# Altium schematic sheet Sheet1.SchDoc
size A; SheetNumber: 2; SheetTotal: 2
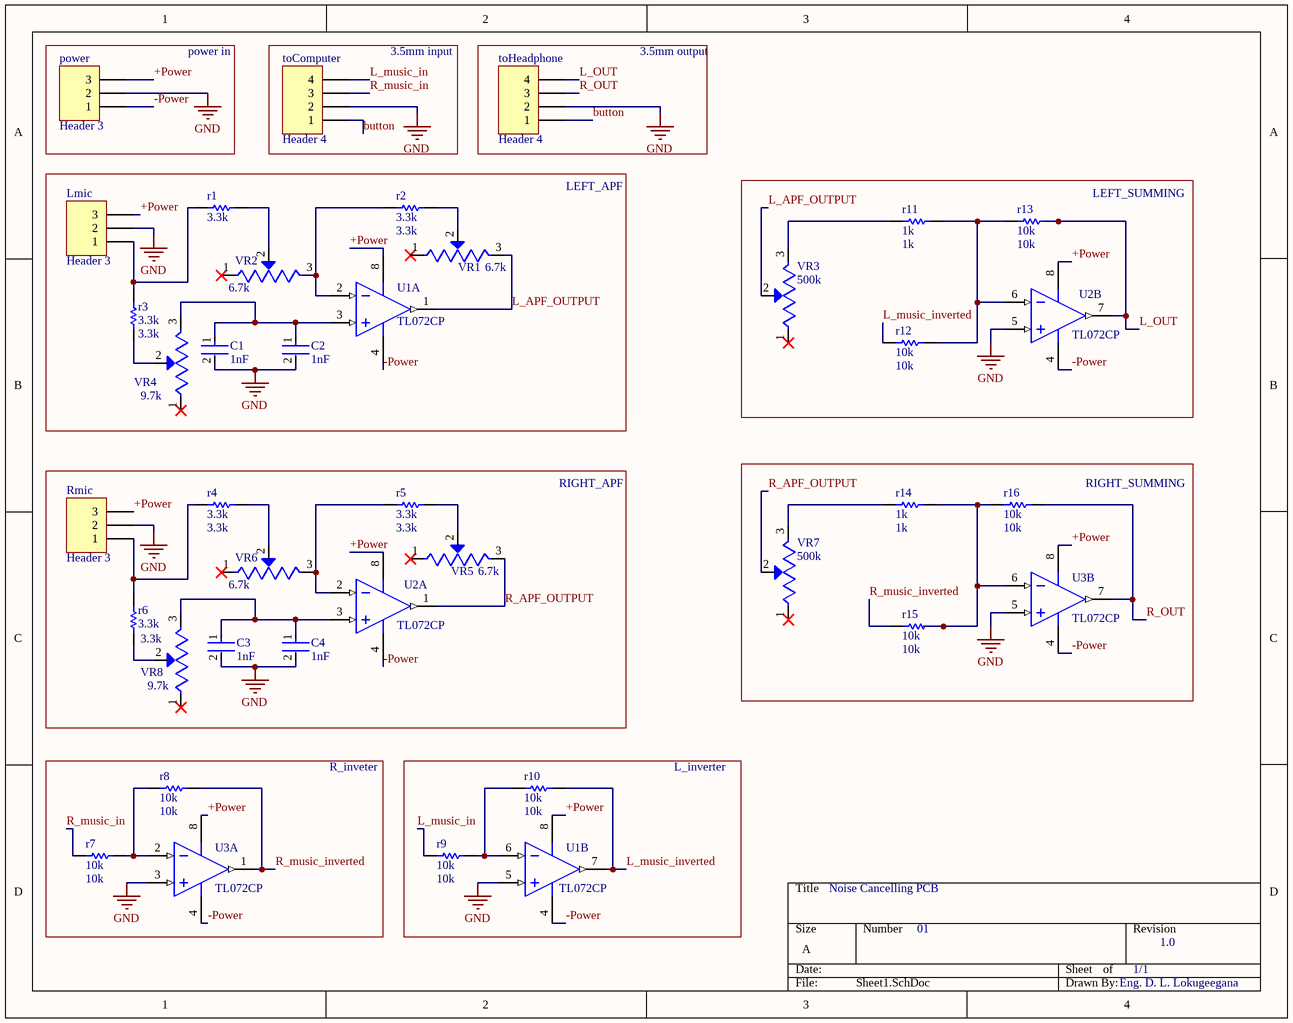
[diagram p0: Sheet1.SchDoc]

## Parts
C1  1nF  [FP-RCE3M1-MFG]
C2  1nF  [FP-RCE3M1-MFG]
C3  1nF  [FP-RCE3M1-MFG]
C4  1nF  [FP-RCE3M1-MFG]
Lmic  Header 3  [HDR1X3]
power  Header 3  [HDR1X3]
r1  3.3k  [AXIAL-0.3]
r2  3.3k  [AXIAL-0.3]
r3  3.3k  [AXIAL-0.3]
r4  3.3k  [AXIAL-0.3]
r5  3.3k  [AXIAL-0.3]
r6  3.3k  [AXIAL-0.3]
r7  10k  [AXIAL-0.3]
r8  10k  [AXIAL-0.3]
r9  10k  [AXIAL-0.3]
r10  10k  [AXIAL-0.3]
r11  1k  [AXIAL-0.3]
r12  10k  [AXIAL-0.3]
r13  10k  [AXIAL-0.3]
r14  1k  [AXIAL-0.3]
r15  10k  [AXIAL-0.3]
r16  10k  [AXIAL-0.3]
Rmic  Header 3  [HDR1X3]
toComputer  Header 4  [HDR1X4]
toHeadphone  Header 4  [HDR1X4]
U1  TL072CP  [P0008A]  (parts A,B of 2)
U2  TL072CP  [P0008A]  (parts A,B of 2)
U3  TL072CP  [P0008A]  (parts A,B of 2)
VR1  6.7k  [TRIM_3296W-1-250]
VR2  6.7k  [TRIM_3296W-1-250]
VR3  500k  [TRIM_3296W-1-250]
VR4  9.7k  [TRIM_3296W-1-250]
VR5  6.7k  [TRIM_3296W-1-250]
VR6  6.7k  [TRIM_3296W-1-250]
VR7  500k  [TRIM_3296W-1-250]
VR8  9.7k  [TRIM_3296W-1-250]

## Blocks framed on the sheet
power in: power
3.5mm input: toComputer
3.5mm output: toHeadphone
LEFT_APF: C1 C2 Lmic r1-r3 U1 VR1 VR2 VR4
LEFT_SUMMING: r11-r13 U2 VR3
RIGHT_APF: C3 C4 r4-r6 Rmic U2 VR5 VR6 VR8
RIGHT_SUMMING: r14-r16 U3 VR7
R_inveter: r7 r8 U3
L_inverter: r9 r10 U1

## Nets
GND: C1.2 C2.2 C3.2 C4.2 Lmic.2 power.2 Rmic.2 toComputer.2 toHeadphone.2 U1.5(IN2+) U2.5(IN2+) U3.3(IN1+) U3.5(IN2+)
+Power: Lmic.3 power.3 Rmic.3 U1.8(VCC+) U2.8(VCC+) U3.8(VCC+)
-Power: power.1 U1.4(VCC-) U2.4(VCC-) U3.4(VCC-)
button: toComputer.1 toHeadphone.1
L_APF_OUTPUT: U1.1(OUT1) VR1.3(CW) VR3.2(WIPER)
L_music_in: r9.1 toComputer.4
L_music_inverted: r10.2 r12.1 U1.7(OUT2)
L_OUT: r13.2 toHeadphone.4 U2.7(OUT2)
R_APF_OUTPUT: U2.1(OUT1) VR5.3(CW) VR7.2(WIPER)
R_music_in: r7.1 toComputer.3
R_music_inverted: r8.2 r15.1 U3.1(OUT1)
R_OUT: r16.2 toHeadphone.3 U3.7(OUT2)
NetC1_1: C1.1 C2.1 U1.3(IN1+) VR4.3(CW)
NetC3_1: C3.1 C4.1 U2.3(IN1+) VR8.3(CW)
NetLmic_1: Lmic.1 r1.1 r3.1
Netr1_2: r1.2 VR2.2(WIPER)
Netr2_1: r2.1 U1.2(IN1-) VR2.3(CW)
Netr2_2: r2.2 VR1.2(WIPER)
Netr3_2: r3.2 VR4.2(WIPER)
Netr4_1: r4.1 r6.2 Rmic.1
Netr4_2: r4.2 VR6.2(WIPER)
Netr5_1: r5.1 U2.2(IN1-) VR6.3(CW)
Netr5_2: r5.2 VR5.2(WIPER)
Netr6_1: r6.1 VR8.2(WIPER)
Netr7_2: r7.2 r8.1 U3.2(IN1-)
Netr9_2: r9.2 r10.1 U1.6(IN2-)
Netr11_1: r11.1 VR3.3(CW)
Netr11_2: r11.2 r12.2 r13.1 U2.6(IN2-)
Netr14_1: r14.1 VR7.3(CW)
Netr14_2: r14.2 r15.2 r16.1 U3.6(IN2-)

Not connected (* = marked no-connect by the designer): VR1 1(CCW)*; VR2 1(CCW)*; VR3 1(CCW)*; VR4 1(CCW)*; VR5 1(CCW)*; VR6 1(CCW)*; VR7 1(CCW)*; VR8 1(CCW)*

## Notes on the sheet
- Noise Cancelling PCB
- 01
- 1/1
- 1.0
- Eng. D. L. Lokugeegana

## Library data of the parts
C1-C4 = CMP-06035-054025-1: Cap Ceramic 10uF 25V X7R ±10% Radial 5mm +125°C Automotive Ammo Pack; Lead Diameter: 0.5mm; Lead/Base Style: Formed Leads; Termination: Radial; Voltage Rating (DC): 25V; Case/Package: Radial; Ratings: AEC-Q200; Dielectric: X7R; Width: 4mm; Max Operating Temperature: 125°C; Capacitance: 10uF; Length: 0.217inch; Lead Pitch: 0.197inch; Height - Seated (Max): 0.197inch; Tolerance: 10%; Voltage Rating: 25V; Height: 5mm; Package Quantity: 500; Mount: Through Hole; Resistor Type: Ceramic; Min Operating Temperature: -55°C; Packaging: Bulk
Lmic power Rmic = Header 3: Header, 3-Pin; LatestRevisionDate: 17-Jul-2002; LatestRevisionNote: Re-released for DXP Platform.; Publisher: Altium Limited
r1 = Res1: Resistor; Value: 4.7k; Published: 8-Jun-2000; LatestRevisionDate: 17-Jul-2002; LatestRevisionNote: Re-released for DXP Platform.; PackageReference: AXIAL-0.3; Publisher: Altium Limited; PackageDescription: Axial Device, Thru-Hole; 2 Leads; 0.3 in Pin Spacing
r2-r16 = Res1: Resistor; Published: 8-Jun-2000; LatestRevisionDate: 17-Jul-2002; LatestRevisionNote: Re-released for DXP Platform.; PackageReference: AXIAL-0.3; Publisher: Altium Limited; PackageDescription: Axial Device, Thru-Hole; 2 Leads; 0.3 in Pin Spacing
  r2-r6: Value: 3.3k
  r7-r10 r12 r13 r15 r16: Value: 10k
  r11 r14: Value: 1k
toComputer toHeadphone = Header 4: Header, 4-Pin; LatestRevisionDate: 17-Jul-2002; LatestRevisionNote: Re-released for DXP Platform.; Publisher: Altium Limited
U1-U3 = CMP-0017-00950-2: Dual Low-Noise JFET-Input General-Purpose Operational Amplifier, 7 to 36 V, 0 to 70 degC, 8-pin DIP (P8), Pb-Free (RoHS); Manufacturer: Texas Instruments; Sub Family: General Purpose Amplifier, High Supply Voltage Amplifier (>=30V); Total Supply Voltage(Max)(+5V is 5, +/-5V is 10): 36; Slew Rate(Typ)(V/us): 13; Vn at 1kHz(Typ)(nV/rtHz): 18; GBW(Typ)(MHz): 3; CMRR(Min)(dB): 70; Total Supply Voltage(Min)(+5V is 5, +/-5V is 10): 7; Vio (25C)(Max)(mV): 10; Rating: Catalog; IIB(Max)(pA): 200; Iq per channel(Max)(mA): 2.5; Number of Channels: 2; Mounting Technology: Through Hole; ComponentLink3Description: Package Specification; PartNumber: TL072CP; PackageVersion: 4040082/E, 04/2010; Eco-Plan: Pb-Free (RoHS); DatasheetVersion: SLOS080J; Offset Drift(Typ)(uV/C): 18; ComponentLink3URL: http://www.ti.com/litv/pdf/mpdi001b; PackageDescription: 8-Pin Plastic In-Line, Body 9.59 x 6.35 mm, Pitch 2.54 mm; Code_JEDEC: MS-001; ComponentLink2URL: http://www.ti.com/lit/ds/symlink/tl072.pdf; ComponentLink1Description: Manufacturer URL; ComponentLink2Description: Datasheet; ComponentLink1URL: http://www.ti.com/; PackageReference: P0008A
VR1-VR8 = 3296W-1-250: 25 Ohms 0.5W, 1/2W PC Pins Through Hole Trimmer Potentiometer Cermet 25.0 Turn Top Adjustment; MF: Bourns; Purchase-URL: https://pricing.snapeda.com/search/part/3296W-1-250/?ref=eda; Check_prices: https://www.snapeda.com/parts/3296W-1-250/Bourns/view-part/?ref=eda; SnapEDA_Link: https://www.snapeda.com/parts/3296W-1-250/Bourns/view-part/?ref=snap; Price: None; Availability: In Stock; Package: NON STANDARD-3 Bourns; MP: 3296W-1-250; Value: *